# EAGLE board base-module-r1 (EAGLE 5.12)
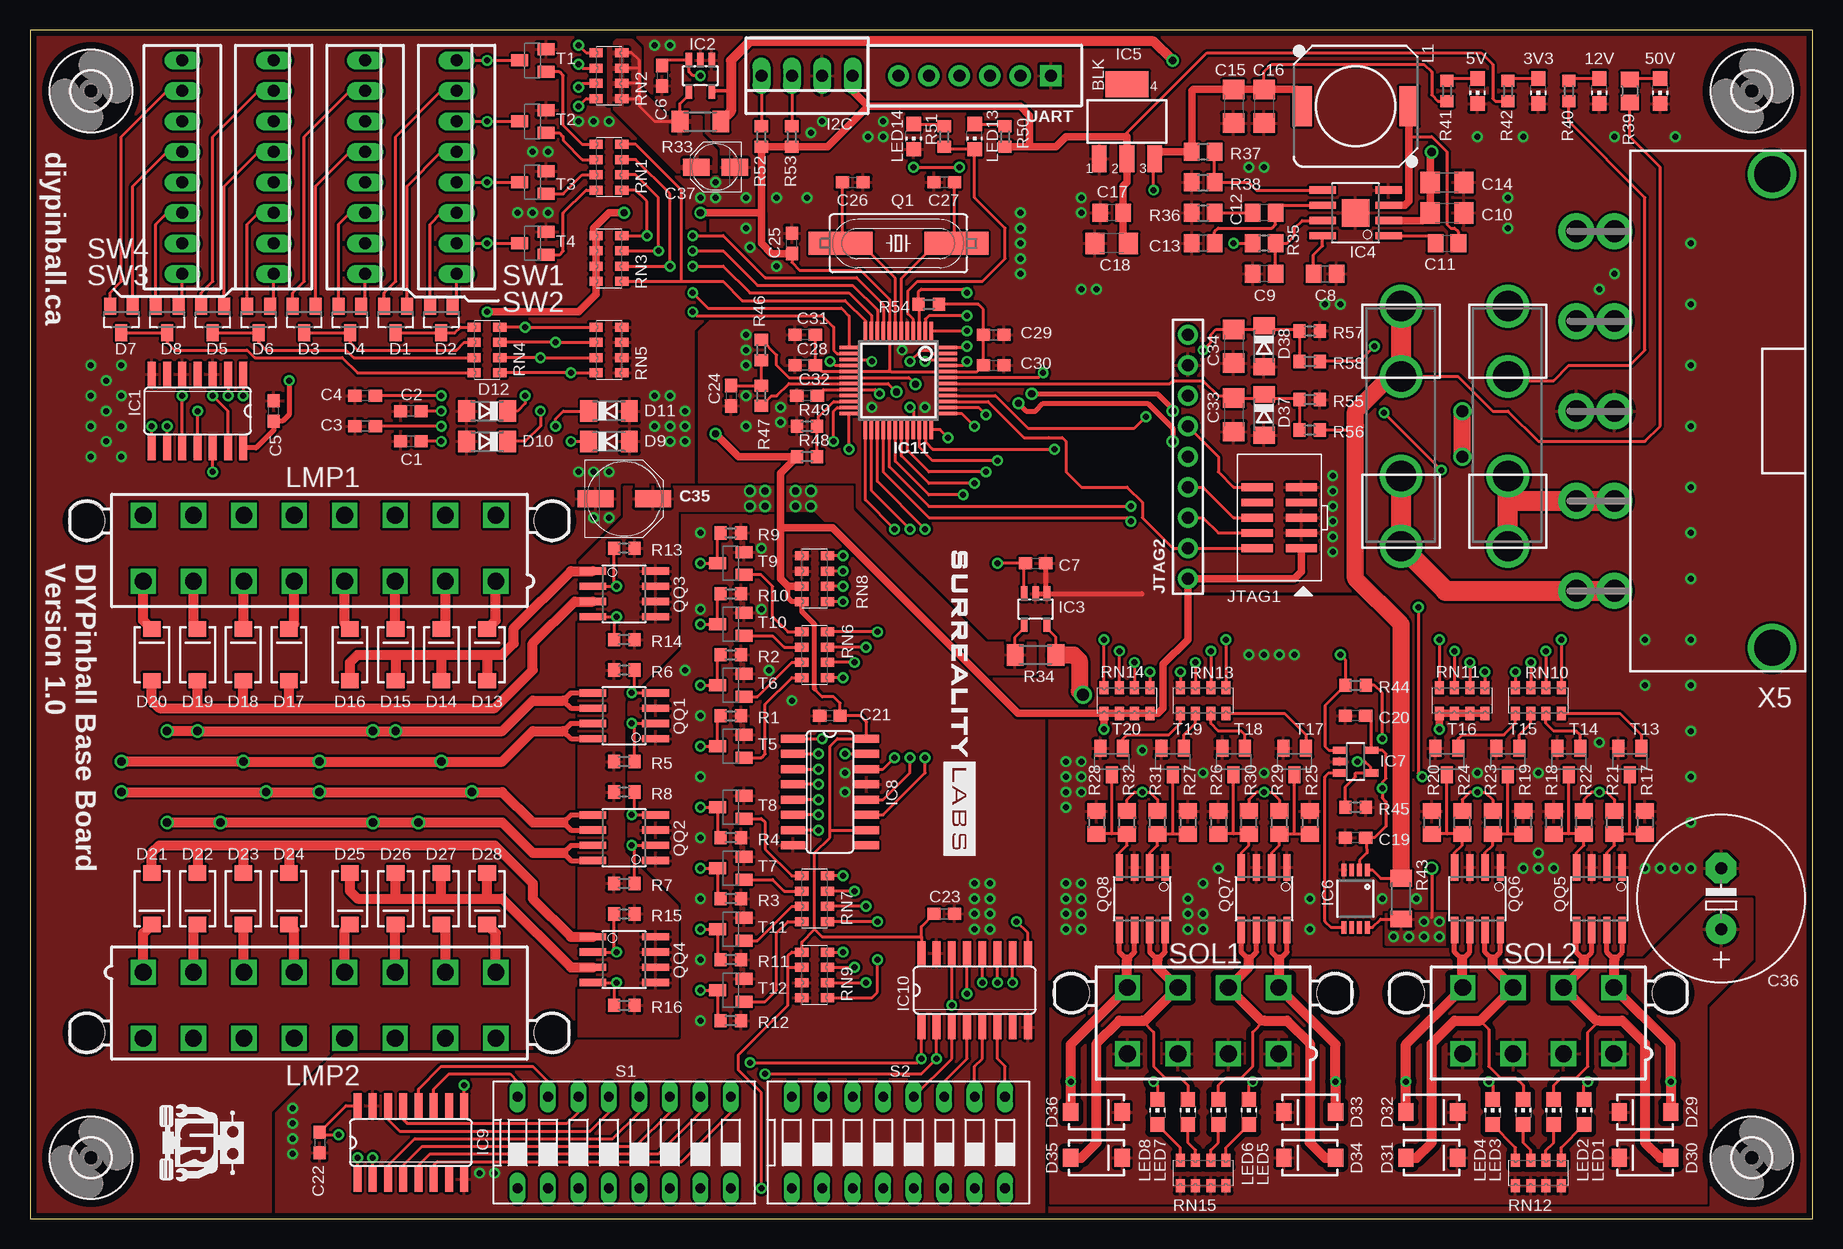
[diagram p4: board, top side]
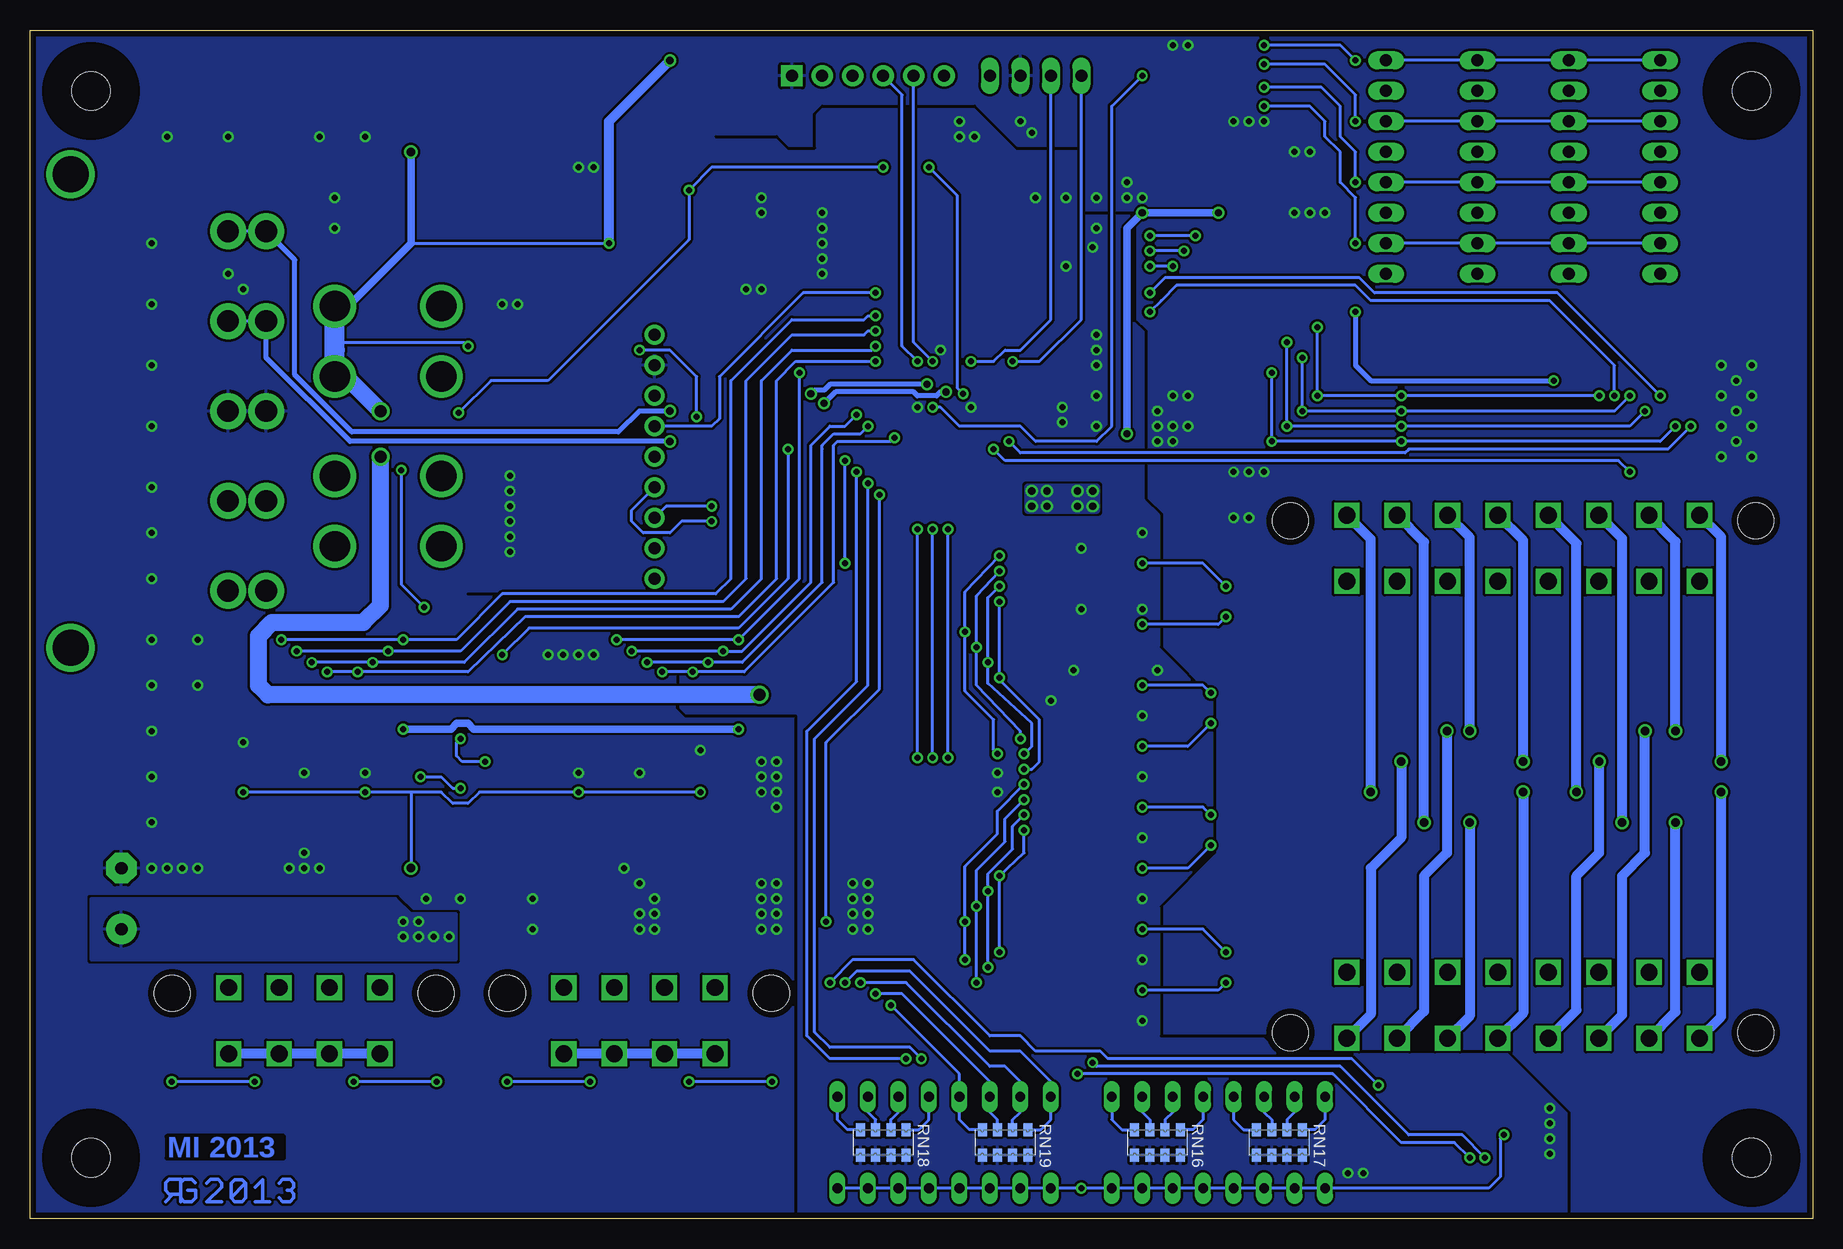
[diagram p5: board, bottom side, seen from below]

Size 148.59 x 99.06 mm. Coordinates in mm from the lower left corner, seen from the top.
Outline: 0,0 148.59,0 148.59,99.06 0,99.06 0,0
Copper layers (1*16): Top 0.035mm / dielectric 1.5mm / Bottom 0.035mm
Design rules "default *": minimum track width 10mil, minimum drill 0.5mm, track to track 8mil, track to pad 8mil, pad to pad 8mil, via to via 8mil, smd to smd 8mil, copper to edge 20mil, drill to drill 8mil, minimum pad ring 10mil, minimum via ring 8mil, stop-mask expansion 4mil, vias tented up to drill 20mil, thermal gap 10mil
Net classes: 1 HV: clearance 0.406 mm
tRestrict: 24 lines
bRestrict: 31 lines

## Footprints (pad centres in the part's own frame; a part is rotated, then mirrored left to right if it is on the bottom)
CHIP-LED0805 = smd 1.2 x 1.2: A 0,-1.05; C 0,1.05
C0603 = smd 1.1 x 1: 1 -0.85,0; 2 0.85,0
C0805 = smd 1.3 x 1.5: 1 -0.95,0; 2 0.95,0
C1206 = smd 1.6 x 1.8: 1 -1.4,0; 2 1.4,0
PANASONIC_D = smd 3 x 1.4: + 2.4,0; - -2.4,0
E5-13 = drill 1.016 pad 2.54 round: + -2.54,0 | drill 1.016 pad 2.54 octagon: - 2.54,0
PANASONIC_B = smd 2.2 x 1.4: + 1.6,0; - -1.6,0
SOT23 = smd 1 x 1.4: 1 -0.95,-1.1; 2 0.95,-1.1; 3 0,1.1
SOD80C = smd 1.4 x 1.8: A 1.7,0; C -1.7,0
SMA-DIODE = smd 1.27 x 1.47: A -2.15,0; C 2.15,0
FUSE_5MM = drill 2.54 pad 3.556 round: 1 0,-10; 2 0,-4.158; 3 0,4.158; 4 0,10
3,2 = hole 3.2: 0,0
22-23-2041 = drill 1 long: 1 -3.81,0; 2 -1.27,0; 3 1.27,0; 4 3.81,0
SO14 = smd 0.66 x 2.032: 1 -3.81,-3.073; 2 -2.54,-3.073; 3 -1.27,-3.073; 4 0,-3.073; 5 1.27,-3.073; 6 2.54,-3.073; 7 3.81,-3.073; 8 3.81,3.073; 9 2.54,3.073; 10 1.27,3.073; 11 0,3.073; 12 -1.27,3.073; 13 -2.54,3.073; 14 -3.81,3.073
SOT23-5L = smd 0.55 x 1.2: 1 -0.95,-1.3; 2 0,-1.3; 3 0.95,-1.3; 4 0.95,1.3; 5 -0.95,1.3
SO08 = smd 0.61 x 2.21: 1 -1.905,-2.75; 2 -0.635,-2.75; 3 0.635,-2.75; 4 1.905,-2.75; 5 1.905,2.75; 6 0.635,2.75; 7 -0.635,2.75; 8 -1.905,2.75 | smd 2.3 x 2.3: SLUG 0,0
SOT223 = smd 1.219 x 2.235: 1 -2.311,-3.099; 2 0,-3.099; 3 2.311,-3.099 | smd 3.6 x 2.2: 4 0,3.099
MSOP-8 = smd 0.41 x 1.02: 1 -0.975,-2.4; 2 -0.325,-2.4; 3 0.325,-2.4; 4 0.975,-2.4; 5 0.975,2.4; 6 0.325,2.4; 7 -0.325,2.4; 8 -0.975,2.4
SOT23-5 = smd 0.6 x 1.2: 1 -0.95,-1.306; 2 0,-1.306; 3 0.95,-1.306; 4 0.95,1.306; 5 -0.95,1.306
SO16 = smd 0.66 x 2.032: 1 -4.445,-3.073; 2 -3.175,-3.073; 3 -1.905,-3.073; 4 -0.635,-3.073; 5 0.635,-3.073; 6 1.905,-3.073; 7 3.175,-3.073; 8 4.445,-3.073; 9 4.445,3.073; 10 3.175,3.073; 11 1.905,3.073; 12 0.635,3.073; 13 -0.635,3.073; 14 -1.905,3.073; 15 -3.175,3.073; 16 -4.445,3.073
LQFP48 = smd 0.3 x 1.6: 1 -2.75,-4.1; 2 -2.25,-4.1; 3 -1.75,-4.1; 4 -1.25,-4.1; 5 -0.75,-4.1; 6 -0.25,-4.1; 7 0.25,-4.1; 8 0.75,-4.1; 9 1.25,-4.1; 10 1.75,-4.1; 11 2.25,-4.1; 12 2.75,-4.1; 25 2.75,4.1; 26 2.25,4.1; 27 1.75,4.1; 28 1.25,4.1; 29 0.75,4.1; 30 0.25,4.1; 31 -0.25,4.1; 32 -0.75,4.1; 33 -1.25,4.1; 34 -1.75,4.1; 35 -2.25,4.1; 36 -2.75,4.1 | smd 1.6 x 0.3: 13 4.1,-2.75; 14 4.1,-2.25; 15 4.1,-1.75; 16 4.1,-1.25; 17 4.1,-0.75; 18 4.1,-0.25; 19 4.1,0.25; 20 4.1,0.75; 21 4.1,1.25; 22 4.1,1.75; 23 4.1,2.25; 24 4.1,2.75; 37 -4.1,2.75; 38 -4.1,2.25; 39 -4.1,1.75; 40 -4.1,1.25; 41 -4.1,0.75; 42 -4.1,0.25; 43 -4.1,-0.25; 44 -4.1,-0.75; 45 -4.1,-1.25; 46 -4.1,-1.75; 47 -4.1,-2.25; 48 -4.1,-2.75
2X05_1.27MM_SMT = smd 0.65 x 2.6: 1 -2.54,-1.85; 2 -2.54,1.85; 3 -1.27,-1.85; 4 -1.27,1.85; 5 0,-1.85; 6 0,1.85; 7 1.27,-1.85; 8 1.27,1.85; 9 2.54,-1.85; 10 2.54,1.85
100MIL-9 = drill 1 pad 1.676 round: 1 -10.16,0; 2 -7.62,0; 3 -5.08,0; 4 -2.54,0; 5 0,0; 6 2.54,0; 7 5.08,0; 8 7.62,0; 9 10.16,0
DR1030 = smd 3.3 x 1.6: 1 0,4.45; 2 0,-4.45
5566-16 = drill 1.4 square: 1 14.7,-2.75; 2 10.5,-2.75; 3 6.3,-2.75; 4 2.1,-2.75; 5 -2.1,-2.75; 6 -6.3,-2.75; 7 -10.5,-2.75; 8 -14.7,-2.75; 9 14.7,2.75; 10 10.5,2.75; 11 6.3,2.75; 12 2.1,2.75; 13 -2.1,2.75; 14 -6.3,2.75; 15 -10.5,2.75; 16 -14.7,2.75 | hole 3: 19.4,2.29; -19.4,2.29
HC49UP = smd 5.334 x 1.93: 1 -4.826,0; 2 4.826,0
SO-8 = smd 2.21 x 0.61: 1 -2.616,1.905; 2 -2.616,0.635; 3 -2.616,-0.635; 4 -2.616,-1.905; 5 2.616,-1.905; 6 2.616,-0.635; 7 2.616,0.635; 8 2.616,1.905
R0603 = smd 1 x 1.1: 1 -0.85,0; 2 0.85,0
R0805 = smd 1.3 x 1.5: 1 -0.95,0; 2 0.95,0
M3516 = smd 1.4 x 1.8: 1 -1.7,0; 2 1.7,0
EXBS8V = smd 0.75 x 1.1: 1 -1.905,-1.07; 2 -0.635,-1.07; 3 0.635,-1.07; 4 1.905,-1.07; 5 1.905,1.07; 6 0.635,1.07; 7 -0.635,1.07; 8 -1.905,1.07
DS-08 = drill 0.813 long: 1 -8.89,-3.81; 2 -6.35,-3.81; 3 -3.81,-3.81; 4 -1.27,-3.81; 5 1.27,-3.81; 6 3.81,-3.81; 7 6.35,-3.81; 8 8.89,-3.81; 9 8.89,3.81; 10 6.35,3.81; 11 3.81,3.81; 12 1.27,3.81; 13 -1.27,3.81; 14 -3.81,3.81; 15 -6.35,3.81; 16 -8.89,3.81
5566-8 = drill 1.4 square: 1 6.3,-2.75; 2 2.1,-2.75; 3 -2.1,-2.75; 4 -6.3,-2.75; 5 6.3,2.75; 6 2.1,2.75; 7 -2.1,2.75; 8 -6.3,2.75 | hole 3: 11,2.29; -11,2.29
22-23-2081 = drill 1 long: 1 -8.89,0; 2 -6.35,0; 3 -3.81,0; 4 -1.27,0; 5 1.27,0; 6 3.81,0; 7 6.35,0; 8 8.89,0
SOT23-BEC = smd 1 x 1.4: B -0.95,-1.1; C 0,1.1; E 0.95,-1.1
USBCABLE-0.100-NOLBL = drill 1 pad 1.778 square: 1 0,-7.62 | drill 1 pad 1.778 round: 2 0,-5.08; 3 0,-2.54; 4 0,0; 5 0,2.54; 6 0,5.08
43160-XX05 = drill 1.8 pad 3 round: 1@1 -14.98,0; 1@2 -14.98,3.18; 2@1 -7.49,0; 2@2 -7.49,3.18; 3@1 0,0; 3@2 0,3.18; 4@1 7.49,0; 4@2 7.49,3.18; 5@1 14.98,0; 5@2 14.98,3.18 | drill 3 pad 3.4 round: M1 -19.73,-13.13; M2 19.73,-13.13

## Placement (x,y rotation side)
3V3  3.3V  [CHIP-LED0805]  125.73,93.98 180 top
5V  5V  [CHIP-LED0805]  120.65,93.98 180 top
12V  12V  [CHIP-LED0805]  130.81,93.98 180 top
50V  PWR  [CHIP-LED0805]  135.89,93.98 180 top
C1  CYA  [C0603]  31.75,64.77 180 top
C2  CYA  [C0603]  31.75,67.31 180 top
C3  CYA  [C0603]  27.94,66.04 180 top
C4  CYA  [C0603]  27.94,68.58 180 top
C5  100n  [C0603]  20.32,67.31 90 top
C6  .047  [C0603]  52.7,95.25 270 top
C7  .047  [C0603]  83.82,54.61 0 top
C8  100n  [C0805]  107.95,78.74 0 top
C9  100n  [C0805]  102.87,78.74 180 top
C10  10u  [C1206]  118.11,83.82 0 top
C11  100n  [C0805]  118.11,81.28 0 top
C12  3.3n  [C0805]  102.87,83.82 180 top
C13  DNP  [C0805]  97.79,81.28 180 top
C14  10u  [C1206]  118.11,86.36 0 top
C15  22u  [C1206]  100.33,92.71 270 top
C16  22u  [C1206]  102.87,92.71 270 top
C17  2.2u  [C0805]  90.17,83.82 180 top
C18  10u  [C1206]  90.17,81.28 180 top
C19  100n  [C0603]  110.49,31.75 180 top
C20  100n  [C0603]  110.49,41.91 180 top
C21  100n  [C0603]  66.67,41.91 180 top
C22  100n  [C0603]  24.13,6.35 270 top
C23  100n  [C0603]  76.2,25.4 0 top
C24  1n  [C0603]  58.42,68.58 270 top
C25  10n  [C0603]  63.5,81.28 90 top
C26  18p  [C0603]  68.58,86.36 0 top
C27  18p  [C0603]  76.2,86.36 180 top
C28  10n  [C0603]  64.61,71.12 180 top
C29  10n  [C0603]  80.33,73.66 0 top
C30  100n  [C0603]  80.33,71.12 0 top
C31  100n  [C0603]  64.61,73.66 180 top
C32  100n  [C0603]  64.77,68.58 180 top
C33  10u  [C1206]  100.33,66.99 270 top
C34  10u  [C1206]  100.33,72.71 270 top
C35  100u  [PANASONIC_D]  49.53,60.01 0 top
C36  220u  [E5-13]  140.97,26.67 90 top
C37  10u  [PANASONIC_B]  57.15,87.63 180 top
D1  BAT54C  [SOT23]  30.48,74.93 180 top
D2  BAT54C  [SOT23]  34.29,74.93 180 top
D3  BAT54C  [SOT23]  22.86,74.93 180 top
D4  BAT54C  [SOT23]  26.67,74.93 180 top
D5  BAT54C  [SOT23]  15.24,74.93 180 top
D6  BAT54C  [SOT23]  19.05,74.93 180 top
D7  BAT54C  [SOT23]  7.62,74.93 180 top
D8  BAT54C  [SOT23]  11.43,74.93 180 top
D9  [SOD80C]  48.26,64.77 0 top
D10  [SOD80C]  38.1,64.77 180 top
D11  [SOD80C]  48.26,67.31 0 top
D12  [SOD80C]  38.1,67.31 180 top
D13  [SMA-DIODE]  38.1,46.99 90 top
D14  [SMA-DIODE]  34.29,46.99 90 top
D15  [SMA-DIODE]  30.48,46.99 90 top
D16  [SMA-DIODE]  26.67,46.99 90 top
D17  [SMA-DIODE]  21.59,46.99 90 top
D18  [SMA-DIODE]  17.78,46.99 90 top
D19  [SMA-DIODE]  13.97,46.99 90 top
D20  [SMA-DIODE]  10.16,46.99 90 top
D21  [SMA-DIODE]  10.16,26.67 270 top
D22  [SMA-DIODE]  13.97,26.67 270 top
D23  [SMA-DIODE]  17.78,26.67 270 top
D24  [SMA-DIODE]  21.59,26.67 270 top
D25  [SMA-DIODE]  26.67,26.67 270 top
D26  [SMA-DIODE]  30.48,26.67 270 top
D27  [SMA-DIODE]  34.29,26.67 270 top
D28  [SMA-DIODE]  38.1,26.67 270 top
D29  [SMA-DIODE]  134.62,8.89 180 top
D30  [SMA-DIODE]  134.62,5.08 180 top
D31  [SMA-DIODE]  116.84,5.08 0 top
D32  [SMA-DIODE]  116.84,8.89 0 top
D33  S1M-FDICT-ND  [SMA-DIODE]  106.68,8.89 180 top
D34  S1M-FDICT-ND  [SMA-DIODE]  106.68,5.08 180 top
D35  S1M-FDICT-ND  [SMA-DIODE]  88.9,5.08 0 top
D36  S1M-FDICT-ND  [SMA-DIODE]  88.9,8.89 0 top
D37  [SOD80C]  102.87,66.99 270 top
D38  [SOD80C]  102.87,72.71 270 top
F1  FUSEX20MM(50A)  [FUSE_5MM]  114.3,66.04 0 top
F2  FUSEX20MM(25A)  [FUSE_5MM]  123.19,66.04 0 top
H1  MOUNT-HOLE3.2  [3,2]  5.08,5.08 0 top
H2  MOUNT-HOLE3.2  [3,2]  143.51,5.08 0 top
H3  MOUNT-HOLE3.2  [3,2]  5.08,93.98 0 top
H4  MOUNT-HOLE3.2  [3,2]  143.51,93.98 0 top
I2C  22-23-2041  [22-23-2041]  64.77,95.25 180 top
IC1  74HC14D  [SO14]  13.97,67.31 180 top
IC2  TS1102  [SOT23-5L]  55.88,95.25 180 top
IC3  TS1102  [SOT23-5L]  83.82,50.8 180 top
IC4  RT7247A  [SO08]  110.49,83.82 90 top
IC5  LM1117-3.3V  [SOT223]  91.44,91.44 0 top
IC6  LMP8480MM  [MSOP-8]  110.49,26.67 180 top
IC7  MCP6001  [SOT23-5]  110.49,38.1 270 top
IC8  74HC595D  [SO16]  66.67,35.56 270 top
IC9  74HC165D  [SO16]  31.75,6.35 0 top
IC10  74HC165D  [SO16]  78.74,19.05 0 top
IC11  LPC11C22/24-LQFP48  [LQFP48]  72.39,69.85 180 top
JTAG1  [2X05_1.27MM_SMT]  104.14,58.42 90 top
JTAG2  M09-100MIL  [100MIL-9]  96.52,63.5 90 top
L1  10uH  [DR1030]  110.49,92.71 270 top
LED1  [CHIP-LED0805]  129.54,8.89 0 top
LED2  [CHIP-LED0805]  127,8.89 0 top
LED3  [CHIP-LED0805]  124.46,8.89 0 top
LED4  [CHIP-LED0805]  121.92,8.89 0 top
LED5  [CHIP-LED0805]  101.6,8.89 0 top
LED6  [CHIP-LED0805]  99.06,8.89 0 top
LED7  [CHIP-LED0805]  96.52,8.89 0 top
LED8  [CHIP-LED0805]  93.98,8.89 0 top
LED13  HBB  [CHIP-LED0805]  78.74,90.17 180 top
LED14  HBA  [CHIP-LED0805]  73.66,90.17 180 top
LMP1  [5566-16]  24.13,55.88 0 top
LMP2  [5566-16]  24.13,17.78 180 top
Q1  12MHz  [HC49UP]  72.39,81.28 0 top
QQ1  DMN6040SSD  [SO-8]  49.53,41.91 180 top
QQ2  DMN6040SSD  [SO-8]  49.53,31.75 180 top
QQ3  IRF9362  [SO-8]  49.53,52.07 0 top
QQ4  IRF9362  [SO-8]  49.53,21.59 0 top
QQ5  DMN6040SSD  [SO-8]  130.81,26.67 270 top
QQ6  DMN6040SSD  [SO-8]  120.65,26.67 270 top
QQ7  DMN6040SSD  [SO-8]  102.87,26.67 270 top
QQ8  DMN6040SSD  [SO-8]  92.71,26.67 270 top
R1  100K  [R0603]  58.42,41.91 180 top
R2  100K  [R0603]  58.42,46.99 180 top
R3  100K  [R0603]  58.42,26.67 180 top
R4  100K  [R0603]  58.42,31.75 180 top
R5  68K  [R0603]  49.53,38.1 180 top
R6  68K  [R0603]  49.53,45.72 180 top
R7  68K  [R0603]  49.53,27.94 180 top
R8  68K  [R0603]  49.53,35.56 180 top
R9  100K  [R0603]  58.42,57.15 180 top
R10  100K  [R0603]  58.42,52.07 180 top
R11  100K  [R0603]  58.42,21.59 180 top
R12  100K  [R0603]  58.42,16.51 180 top
R13  68K  [R0603]  49.53,55.88 0 top
R14  68K  [R0603]  49.53,48.26 0 top
R15  68K  [R0603]  49.53,25.4 0 top
R16  68K  [R0603]  49.53,17.78 0 top
R17  100K  [R0805]  134.62,33.02 270 top
R18  100K  [R0805]  127,33.02 270 top
R19  100K  [R0805]  124.46,33.02 270 top
R20  100K  [R0805]  116.84,33.02 270 top
R21  240K  [R0805]  132.08,33.02 90 top
R22  240K  [R0805]  129.54,33.02 90 top
R23  240K  [R0805]  121.92,33.02 90 top
R24  240K  [R0805]  119.38,33.02 90 top
R25  100K  [R0805]  106.68,33.02 270 top
R26  100K  [R0805]  99.06,33.02 270 top
R27  100K  [R0805]  96.52,33.02 270 top
R28  100K  [R0805]  88.9,33.02 270 top
R29  240K  [R0805]  104.14,33.02 90 top
R30  240K  [R0805]  101.6,33.02 90 top
R31  240K  [R0805]  93.98,33.02 90 top
R32  240K  [R0805]  91.44,33.02 90 top
R33  0.02(MCS1632R020FER)  [M3516]  55.88,91.44 180 top
R34  0.003(PMR18EZPFV3L00)  [M3516]  83.82,46.99 180 top
R35  100K  [R0805]  102.87,81.28 180 top
R36  20K  [R0805]  97.79,83.82 0 top
R37  62K  [R0805]  97.79,88.9 180 top
R38  11.8K  [R0805]  97.79,86.36 0 top
R39  2.2K  [R0805]  133.35,93.98 270 top
R40  1K  [R0603]  128.27,93.98 270 top
R41  330  [R0603]  118.11,93.98 270 top
R42  220  [R0603]  123.19,93.98 270 top
R43  0.001 (CSR1206-0R001F1)  [M3516]  114.3,26.67 270 top
R44  680  [R0603]  110.49,44.45 180 top
R45  1K  [R0603]  110.49,34.29 180 top
R46  60  [R0603]  60.96,72.39 90 top
R47  60  [R0603]  60.96,68.58 90 top
R48  DNP  [R0603]  64.77,63.5 180 top
R49  0  [R0603]  64.77,66.04 180 top
R50  100  [R0603]  81.28,90.17 270 top
R51  100  [R0603]  76.2,90.17 270 top
R52  10K  [R0603]  60.96,90.17 270 top
R53  10K  [R0603]  63.5,90.17 270 top
R54  12K  [R0603]  74.93,76.2 0 top
R55  100K  [R0603]  106.68,68.26 180 top
R56  1.6M  [R0603]  106.68,65.72 0 top
R57  100K  [R0603]  106.68,73.98 180 top
R58  300K  [R0603]  106.68,71.44 0 top
RN1  1K  [EXBS8V]  48.26,87.63 90 top
RN2  10K  [EXBS8V]  48.26,95.25 270 top
RN3  10K  [EXBS8V]  48.26,80.01 90 top
RN4  1K  [EXBS8V]  38.1,72.39 270 top
RN5  10K  [EXBS8V]  48.26,72.39 90 top
RN6  1K  [EXBS8V]  65.41,46.99 90 top
RN7  1K  [EXBS8V]  65.41,26.67 90 top
RN8  10K  [EXBS8V]  65.41,53.34 90 top
RN9  10K  [EXBS8V]  65.41,20.32 270 top
RN10  1K  [EXBS8V]  125.73,43.18 180 top
RN11  10K  [EXBS8V]  119.38,43.18 180 top
RN12  2.2K  [EXBS8V]  125.73,3.81 180 top
RN13  1K  [EXBS8V]  97.79,43.18 180 top
RN14  10K  [EXBS8V]  91.44,43.18 180 top
RN15  2.2K  [EXBS8V]  97.79,3.81 180 top
RN16  10K  [EXBS8V]  54.61,6.35 0 bottom
RN17  10K  [EXBS8V]  44.45,6.35 0 bottom
RN18  10K  [EXBS8V]  77.47,6.35 0 bottom
RN19  10K  [EXBS8V]  67.31,6.35 0 bottom
S1  219-8MST  [DS-08]  49.53,6.35 0 top
S2  219-8MST  [DS-08]  72.39,6.35 0 top
SOL1  [5566-8]  97.79,16.51 0 top
SOL2  [5566-8]  125.73,16.51 0 top
SW1  22-23-2081  [22-23-2081]  35.56,87.63 270 top
SW2  22-23-2081  [22-23-2081]  27.94,87.63 270 top
SW3  22-23-2081  [22-23-2081]  20.32,87.63 270 top
SW4  22-23-2081  [22-23-2081]  12.7,87.63 270 top
T1  MMBT3904  [SOT23-BEC]  41.91,96.52 90 top
T2  MMBT3904  [SOT23-BEC]  41.91,91.44 90 top
T3  MMBT3904  [SOT23-BEC]  41.91,86.36 90 top
T4  MMBT3904  [SOT23-BEC]  41.91,81.28 90 top
T5  MMBT3904  [SOT23-BEC]  58.42,39.37 90 top
T6  MMBT3904  [SOT23-BEC]  58.42,44.45 90 top
T7  MMBT3904  [SOT23-BEC]  58.42,29.21 90 top
T8  MMBT3904  [SOT23-BEC]  58.42,34.29 90 top
T9  MMBT3904  [SOT23-BEC]  58.42,54.61 90 top
T10  MMBT3904  [SOT23-BEC]  58.42,49.53 90 top
T11  MMBT3904  [SOT23-BEC]  58.42,24.13 90 top
T12  MMBT3904  [SOT23-BEC]  58.42,19.05 90 top
T13  MMBT3904  [SOT23-BEC]  133.35,38.1 180 top
T14  MMBT3904  [SOT23-BEC]  128.27,38.1 180 top
T15  MMBT3904  [SOT23-BEC]  123.19,38.1 180 top
T16  MMBT3904  [SOT23-BEC]  118.11,38.1 180 top
T17  MMBT3904  [SOT23-BEC]  105.41,38.1 180 top
T18  MMBT3904  [SOT23-BEC]  100.33,38.1 180 top
T19  MMBT3904  [SOT23-BEC]  95.25,38.1 180 top
T20  MMBT3904  [SOT23-BEC]  90.17,38.1 180 top
U$1  [RGLOGO_SMALL_2013]  135.89,1.27 0 bottom
U$2  [SURREALITY_LOGO_SILK]  76.2,55.88 270 top
U$3  UR_LOGO10  [UR_LOGO_10X10]  13.97,6.35 270 top
UART  TTL-232R-5VN  [USBCABLE-0.100-NOLBL]  77.47,95.25 90 top
X5  43160-3105  [43160-XX05]  132.08,67.31 90 top

## Tracks (layer width: path | path; a pad name or v marks a point on that pad's centre or on a via)
12V_SENSE  (via drill 0.5)
  Top 0.254: R58.1 R57.2 105.7,74.11 102.87,74.11 | 102.87,74.11 C34.1 98.87,74.11 98.42,73.66 98.42,73.03 v97.79,72.39 | 102.87,74.11 D38.C | IC11.40 80.47,68.6 83.19,65.88 92.08,65.88 v93.03,66.83
  Bottom 0.254: v93.03,66.83 93.03,70.17 95.25,72.39 v97.79,72.39
50V_SENSE
  Top 0.254: R56.1 R55.2 105.7,68.39 102.87,68.39 | 102.87,68.39 C33.1 100.14,68.58 99.06,68.58 97.79,69.85 95.25,69.85 95,69.6 IC11.42 | 102.87,68.39 D37.C
+3V3  (via drill 0.5, 0.6)
  Top 0.254: 71.75,70.6 IC11.44 78.96,70.6 C30.1 C29.1 79.48,75.78 79.06,76.2 R54.2 | 71.75,70.6 IC11.17 65.98,70.6 C28.1 C31.1 | 71.75,70.6 71.64,70.72 IC11.8 71.64,76.63 69.22,79.06 64.14,79.06 63.5,79.69 C25.1 | 63.18,20.95 63.18,21.91 63.5,22.23 RN9.1 64.33,23.06 65.41,24.13 | 66.67,32.38 66.67,39.37 67.31,40.01 IC8.16 69.75,41.38 69.22,41.91 C21.1 67.53,42.97 66.99,43.5 66.04,43.5 65.41,44.13 | 66.67,32.38 IC8.10 | 65.41,24.13 65.41,30.48 66.67,31.75 66.67,32.38 | 74.3,23.5 IC10.16 | 74.3,23.5 74.3,24.34 C23.1 | IC9.16 26.35,9.42 C22.1 24.34,6.99 v25.72,6.99 | 66.46,89.32 68.58,91.44 | R42.2 122.14,93.13 121.92,93.34 121.92,96.2 120.97,97.16 98.11,97.16 91.44,90.49 91.44,90.17 | 91.44,88.9 IC5.2 | 63.18,20.95 RN9.2 | 63.18,20.95 63.18,17.78 59.05,13.65 59.05,12.38 60.96,10.48 v60.96,2.54 | 65.41,24.13 66.04,23.5 74.3,23.5 | 96.52,48.26 94.61,46.35
  Top 0.406: IC1.14 18.83,64.24 20.32,65.72 C5.1 21.06,66.46 21.59,66.99 v21.59,69.85 | 65.41,44.13 65.41,49.53 64.33,50.6 RN8.8 63.5,51.44 63.18,51.75 63.18,52.7
  Top 0.61: IC5.2 91.44,86.36 91.12,86.04 C17.1 91.12,81.73 C18.1 | RN14.5 v89.53,40.8 | C25.1 61.81,80.43 60.96,81.28 60.96,83.82 | 60.96,83.82 R52.2 R53.2 66.46,89.32 69.85,92.71 | 83.33,89.32 R50.2 | 83.33,89.32 85.51,89.32 86.36,90.17 91.44,90.17 91.44,88.9 | 83.33,89.32 83.33,91.93 82.55,92.71 69.85,92.71 | I2C.1 68.58,93.98 69.85,92.71 | v49.53,83.82 48.26,83.82 46.99,82.55 46.99,82.11 RN3.5 RN3.6 RN3.7 RN3.8 47.19,77.03 45.72,75.56 v38.1,75.56 | v55.88,83.82 60.96,83.82 | v57.15,65.41 59.05,63.5 R48.2 62.55,62.13 62.55,57.57 | 62.55,57.57 62.55,53.34 63.18,52.7 RN8.7 | 62.55,57.57 66.89,57.57 82.35,42.11 RN14.5 | v117.47,40.8 RN11.5 RN11.6 RN11.7 RN11.8 | RN14.5 RN14.6 RN14.7 RN14.8 94.02,42.11 94.46,42.55 94.46,46.2 96.52,48.26 JTAG2.1 105.41,53.34 105.99,53.92 JTAG1.1
  Bottom 0.254: S2.8 S2.7 S2.6 S2.5 S2.4 S2.3 S2.2 S2.1 v60.96,2.54 S1.8 S1.7 S1.6 S1.5 S1.4 S1.3 S1.2 S1.1 26.99,2.54 26.04,3.49 26.04,6.67 v25.72,6.99
  Bottom 0.406: v38.1,75.56 38.1,71.12 36.83,69.85 v21.59,69.85
  Bottom 0.61: v89.53,40.8 111.6,40.8 112.08,41.27 113.03,41.27 113.51,40.8 v117.47,40.8 | v49.53,83.82 v55.88,83.82 57.15,82.55 v57.15,65.41
+5V  (via drill 0.5)
  Top 0.254: IC6.2 110.81,29.85 111.44,30.48 C19.1 112.08,31.75 113.03,32.7 113.03,34.77 112.71,35.08 v112.71,35.88 112.71,36.35 113.03,36.67 113.03,38.73 112.71,39.05 IC7.5 111.8,41.45 C20.1 | C32.1 66.14,69.1 IC11.20 70.44,69.1 v70.8,68.74 | R41.2 117.37,93.13 116.84,93.66 116.84,95.57 116.2,96.2 103.5,96.2 102.87,95.57 C16.1 | v73.66,87.63 v77.47,87.63 | v93.66,85.72 93.66,88.25 IC5.3 | v112.87,67.15 v117.63,62.39 | v115.73,50.96 115.73,37.15 v116.05,36.83
  Top 0.61: L1.2 106.05,93.66 105.6,94.11 C16.1 C15.1 96.97,94.11 96.84,93.98 R37.2 | R37.2 | R37.2 94.31,88.9 IC5.3
  Bottom 0.254: v70.8,68.74 71.28,69.22 71.28,85.25 v73.66,87.63 | v77.47,87.63 91.76,87.63 v93.66,85.72 93.66,81.6 105.41,69.85 110.17,69.85 v112.87,67.15 | v116.05,36.83 114.3,36.83 113.35,35.88 v112.71,35.88 | v115.73,50.96 117.63,52.86 v117.63,62.39 | v112.87,67.15
+12V  (via drill 0.5, 0.6, 0.7, 1)
  Top 0.254: 56.83,93.67 IC2.5 | IC3.5 84.77,49.22 85.52,48.47 R34.1 | R40.2 128.27,91.44 134.62,85.09 134.62,72.39 133.35,71.12 128.27,71.12 127,69.85 123.54,69.85 F2.3 | v100.33,81.28 R35.2 | v112.08,72.71 110.81,71.44 R58.2
  Top 0.305: 56.83,93.67 57.15,93.98 58.42,93.98
  Top 0.61: IC4.2 116.08,83.19 C10.1 C14.1 116.71,88.77 v116.84,88.9
  Top 0.813: R33.1 58.42,92.28 58.42,93.98 58.42,96.52 60.01,98.11 93.66,98.11 v95.25,96.52
  Top 1.422: R34.1 87,46.99 87.47,46.51 87.47,43.97 v87.79,43.66 | v119.38,63.5 v119.38,67.31
  Bottom 0.254: 116.84,81.28 v100.33,81.28 | v112.08,72.71 112.39,73.03 122.56,73.03 123.19,72.39
  Bottom 0.61: v116.84,88.9 116.84,81.28 121.92,76.2 123.03,76.2 F2.4
  Bottom 0.813: v95.25,96.52 100.33,91.44 v100.33,81.28
  Bottom 1.422: v87.79,43.66 128.75,43.66 129.54,44.45 129.54,48.58 128.43,49.69 120.81,49.69 119.38,51.12 v119.38,63.5 | v119.38,67.31 122.27,70.2 F2.3
  Bottom 1.676: F2.3 123.19,72.39 F2.4 123.19,76.2
CANH  (via drill 0.6)
  Top 0.254: R47.1 61.81,68.58 62.23,68.58 63.25,69.6 IC11.19 71.53,69.6 v72.23,68.9
  Top 0.406: v82.39,67.94 83.03,67.31 83.82,67.31 84.45,67.94 93.19,67.94 95.25,65.88 v95.25,64.77
  Bottom 0.254: X5.4@2 X5.4@1 | X5.4@2 128.4,74.8 128.27,74.93 128.77,74.93 X5.4@2
  Bottom 0.406: v72.23,68.9 72.71,68.9 73.03,68.58 74.61,68.58 74.93,68.9 81.44,68.9 v82.39,67.94 | v95.25,64.77 121.92,64.77 128.91,71.75 X5.4@2
CANL  (via drill 0.6)
  Top 0.254: R46.2 62.23,71.97 62.23,71.12 63.25,70.1 IC11.18 73.25,70.1 v73.82,69.53
  Top 0.406: v83.5,68.74 93.98,68.74 95.25,67.47 v95.25,67.31
  Bottom 0.254: X5.5@2 X5.5@1
  Bottom 0.406: v73.82,69.53 81.92,69.53 82.39,69.06 83.19,69.06 v83.5,68.74 | v95.25,67.31 97.79,67.31 99.54,65.56 121.76,65.56 126.52,70.33 126.52,79.91 X5.5@2 | X5.5@1 132.08,82.07
DIP_CLK  (via drill 0.5)
  Top 0.254: v61.28,12.06 74.3,12.06 v75.56,13.34 IC10.2 | IC9.2 v28.57,5.08 | IC11.32 73.14,64.02 74.93,62.23 v79.69,62.23
  Bottom 0.254: v61.28,12.06 40.01,12.06 34.29,6.35 29.84,6.35 v28.57,5.08 | v75.56,13.34 81.92,13.34 83.82,15.24 83.82,40.64 79.69,44.77 v79.69,62.23
DIP_DAT  (via drill 0.5)
  Top 0.254: IC10.9 83.19,23.81 v82.23,24.77 | v77.79,60.33 74.93,60.33 72.14,63.12 IC11.30
  Bottom 0.254: v82.23,24.77 82.23,39.69 77.79,44.13 v77.79,60.33
DIP_LAT  (via drill 0.5)
  Top 0.254: v60.01,13.02 73.98,13.02 v74.3,13.34 IC10.1 | IC9.1 v27.3,5.08 | v78.74,61.28 74.93,61.28 72.64,63.57 IC11.31
  Bottom 0.254: v60.01,13.02 59.69,12.7 39.37,12.7 33.66,6.99 29.21,6.99 v27.3,5.08 | v74.3,13.34 75.25,14.29 81.92,14.29 83.19,15.56 83.19,40.01 78.74,44.45 v78.74,61.28
FTDI_RXD  (via drill 0.5)
  Top 0.254: IC11.47 75.22,72.1 74.93,72.39 74.3,72.39 v73.34,71.44
  Bottom 0.254: v73.34,71.44 74.93,73.03 UART.5
FTDI_TXD  (via drill 0.5)
  Top 0.254: IC11.46 74.78,71.6 v74.61,71.44
  Bottom 0.254: v74.61,71.44 75.88,72.71 75.88,93.66 UART.4
GND  (via drill 0.5)
  Top 0.406: C7.2 84.67,52.2 IC3.1 | IC3.2 IC3.1 | IC3.1 92.68,52.1 92.71,52.07
  other vias: 72.71,72.39 74.61,67.63 70.17,67.63 62.55,67.63 62.55,66.36 37.47,3.81 38.73,3.81 78.74,25.4 87.63,35.56 86.36,35.56 86.36,34.29 86.36,36.83 87.63,36.83 87.63,38.1 86.36,38.1 78.74,26.67 80.01,26.67 80.01,25.4 80.01,24.13 78.74,24.13 78.74,27.94 80.01,27.94 86.36,27.94 86.36,26.67 86.36,25.4 86.36,24.13 87.63,24.13 87.63,25.4 87.63,26.67 87.63,27.94 52.07,68.58 52.07,66.04 53.34,64.77 53.34,66.04 53.34,68.58 54.61,67.31 54.61,66.04 54.61,64.77 59.69,68.58 59.69,66.04 40.64,83.82 41.91,83.82 43.18,83.82 41.91,88.9 43.18,88.9 5.08,71.12 5.08,68.58 5.08,66.04 5.08,63.5 6.35,64.77 6.35,67.31 6.35,69.85 7.62,71.12 7.62,68.58 7.62,66.04 7.62,63.5 52.07,97.79 53.34,97.79 64.77,85.09 62.23,85.09 59.69,85.09 66.04,91.44 65.09,90.49 71.12,91.44 71.12,90.17 69.85,90.17 87.63,83.82 87.63,85.09 87.63,77.47 88.9,77.47 109.22,76.2 107.95,76.2 101.6,87.63 102.87,87.63 120.65,90.17 124.46,90.17 132.08,90.17 123.19,85.09 123.19,82.55 137.16,90.17 138.43,81.28 138.43,76.2 132.08,78.74 130.81,77.47 138.43,71.12 138.43,66.04 138.43,60.96 138.43,57.15 138.43,53.34 138.43,48.26 134.62,48.26 134.62,44.45 138.43,44.45 138.43,40.64 138.43,36.83 138.43,33.02 138.43,29.21 137.16,29.21 134.62,29.21 135.89,29.21 125.73,30.48 124.46,29.21 125.73,29.21 127,29.21 21.91,9.21 21.91,7.94 21.91,6.67 21.91,5.4 46.99,91.44 48.26,91.44 45.72,91.44 82.55,78.74 82.55,80.01 82.55,81.28 82.55,82.55 82.55,83.82 108.58,61.91 108.58,60.64 108.58,59.37 108.58,58.1 108.58,56.83 108.58,55.56 101.6,46.99 102.87,46.99 104.14,46.99 105.41,46.99 67.94,37.15 67.94,35.56 55.88,21.59 55.88,26.67 55.88,31.75 55.88,36.83 55.88,16.51 55.88,41.91 54.61,45.72 55.88,50.8 55.88,57.15 60.96,55.88 60.96,50.8 61.59,45.72 63.5,43.18 92.71,39.05 97.79,37.15 102.87,37.15 120.65,37.15 125.73,37.15 130.81,39.69 97.79,24.13 96.52,26.67 96.52,24.13 96.52,25.4 97.79,27.94 99.06,29.21 97.79,25.4 106.68,26.67 106.68,24.13 112.71,26.67 115.57,26.67 59.69,71.12 59.69,72.39 59.69,73.66 62.23,79.38 59.69,82.55 60.01,80.96 45.72,62.23 46.99,62.23 48.26,62.23 46.99,58.42 48.26,58.42 57.15,85.09 55.88,85.09 57.15,86.36
  pour Bottom (rank 6): -1.27,100.33 -1.27,-1.27 149.86,-1.27 149.86,100.33
  pour Top (rank 6): -1.27,100.33 149.86,100.33 149.86,-2.54 -1.27,-2.54
HEARTBEAT
  Top 0.254: R51.2 76.4,89.12 LED13.C 78.74,85.09 81.28,82.55 81.28,80.01 79.38,78.11 73.98,78.11 73.18,77.31 73.18,75.41 73.64,74.95 IC11.4
LAMP_12V  (via drill 0.6)
  Top 0.254: IC3.4 82.87,49.22 82.12,48.47 R34.2
  other vias: 60.01,60.64 60.01,59.37 61.28,60.64 61.28,59.37 63.82,59.37 63.82,60.64 65.09,60.64 65.09,59.37
  pour Top: 53.98,15.24 53.98,26.04 49.53,30.48 49.53,43.18 53.98,47.62 53.98,59.05 65.41,59.05 78.74,45.4 83.82,45.4 83.82,47.94 79.69,47.94 68.58,59.05 68.58,60.96 49.53,60.96 49.53,58.42 45.72,54.61 45.72,15.24
  pour Bottom: 59.69,60.96 59.69,59.05 65.41,59.05 65.41,60.96
LAMP_CLK  (via drill 0.5)
  Top 0.254: IC11.27 70.64,61.44 v74.61,57.47 | v74.61,38.42 74.61,37.15 71.12,33.66 IC8.11
  Bottom 0.254: v74.61,38.42 v74.61,57.47
LAMP_COL0  (via drill 0.5)
  Top 0.254: v67.79,45.09 RN6.1 | v67.79,51.44 RN8.1 | IC8.3 v65.72,37.47
  Bottom 0.254: v67.79,51.44 v67.79,45.09 67.63,44.77 64.45,41.59 64.45,38.1 65.09,37.47 v65.72,37.47
LAMP_COL0_PWR  (via drill 0.7)
  Top 0.406: QQ1.7 45.09,41.27 44.45,40.64 45.09,40.01 QQ1.8
  Top 0.813: 44.45,40.64 41.91,40.64 39.37,38.1 v34.29,38.1 v24.13,38.1 v17.78,38.1 v7.62,38.1
  Bottom 0.813: LMP1.16 7.62,56.82 v7.62,38.1 | LMP1.12 24.13,56.53 v24.13,38.1 | LMP2.16 36.83,17.03 36.83,29.21 34.29,31.75 v34.29,38.1 | LMP2.12 19.68,17.38 19.68,28.57 17.78,30.48 v17.78,38.1
LAMP_COL1  (via drill 0.5)
  Top 0.254: v68.74,46.35 RN6.2 | v67.79,52.7 RN8.2 | IC8.2 v65.72,38.73
  Bottom 0.254: v67.79,52.7 68.74,51.75 v68.74,46.35 68.74,44.61 65.09,41.27 65.09,39.37 v65.72,38.73
LAMP_COL1_PWR  (via drill 0.7)
  Top 0.406: QQ1.6 45.09,42.55 44.45,43.18 45.09,43.81 QQ1.5
  Top 0.813: v11.43,40.64 v13.97,40.64 v28.57,40.64 v30.48,40.64 39.37,40.64 41.91,43.18 44.45,43.18
  Bottom 0.813: LMP1.11 28.57,56.77 v28.57,40.64 | LMP1.15 11.43,56.43 v11.43,40.64 | LMP2.11 15.88,16.98 15.88,28.57 13.97,30.48 v13.97,40.64 | LMP2.15 32.38,17.27 32.38,28.57 30.48,30.48 v30.48,40.64
LAMP_COL2  (via drill 0.5)
  Top 0.254: v68.74,27.3 RN7.3 | RN9.7 v68.74,20.95 | v65.72,33.66 IC8.6
  Bottom 0.254: v68.74,20.95 v68.74,27.3 68.74,28.73 66.67,30.8 66.67,32.7 v65.72,33.66
LAMP_COL2_PWR  (via drill 0.7)
  Top 0.406: QQ2.8 45.09,29.84 44.45,30.48 45.09,31.11 QQ2.7
  Top 0.813: 44.45,30.48 41.91,30.48 39.37,33.02 v32.38,33.02 v28.57,33.02 v15.88,33.02 v11.43,33.02
  Bottom 0.813: v11.43,33.02 11.43,17.23 LMP2.10 | LMP1.10 32.38,56.38 v32.38,33.02 | LMP1.14 15.88,56.67 v15.88,33.02 | LMP2.14 28.57,16.89 v28.57,33.02
LAMP_COL3  (via drill 0.5)
  Top 0.254: RN9.8 v67.79,22.23 | v67.79,28.57 RN7.4 | v65.72,32.38 IC8.7
  Bottom 0.254: v67.79,22.23 v67.79,28.57 65.72,30.48 v65.72,32.38
LAMP_COL3_PWR  (via drill 0.7)
  Top 0.406: QQ2.6 45.09,32.38 44.45,33.02 45.09,33.66 QQ2.5
  Top 0.813: 44.45,33.02 41.91,33.02 39.37,35.56 v36.83,35.56 v24.13,35.56 v19.68,35.56 v7.62,35.56
  Bottom 0.813: LMP2.9 7.62,16.84 v7.62,35.56 | LMP1.9 36.83,56.63 v36.83,35.56 | LMP1.13 19.68,56.28 v19.68,35.56 | LMP2.13 24.13,17.13 v24.13,35.56
LAMP_DAT  (via drill 0.5)
  Top 0.254: IC11.25 69.64,59.9 v72.07,57.47 | v72.07,38.42 71.12,37.47 IC8.14
  Bottom 0.254: v72.07,38.42 v72.07,57.47
LAMP_LAT  (via drill 0.5)
  Top 0.254: IC11.26 70.14,60.67 v73.34,57.47 | v73.34,38.42 73.34,37.15 71.12,34.92 IC8.12
  Bottom 0.254: v73.34,38.42 v73.34,57.47
LAMP_ROW0  (via drill 0.5)
  Top 0.254: v70.64,48.9 RN6.4 | v67.79,55.24 RN8.4 | v67.94,38.73 IC8.15
  Bottom 0.254: v67.79,55.24 70.64,52.23 v70.64,48.9 70.64,43.97 68.26,41.59 68.26,39.05 v67.94,38.73
LAMP_ROW0_PWR
  Top 0.813: D16.A 26.67,46.35 27.3,46.99 30.48,46.99 | 38.1,46.99 39.37,46.99 40.32,47.94 40.32,49.21 45.09,53.98 QQ3.1 | 34.29,46.99 38.1,46.99 | 30.48,46.99 34.29,46.99 | 34.29,46.99 D14.A | 30.48,46.99 D15.A | 38.1,46.99 D13.A
LAMP_ROW1  (via drill 0.5)
  Top 0.254: v69.69,47.62 RN6.3 | v67.79,53.98 RN8.3 | IC8.1 v66.04,40.01
  Bottom 0.254: v67.79,53.98 69.69,51.91 v69.69,47.62 69.69,44.45 66.04,40.64 v66.04,40.01
LAMP_ROW1_PWR
  Top 0.813: D20.A 10.16,43.18 10.79,42.55 13.97,42.55 | 21.59,42.55 38.73,42.55 41.91,45.72 41.91,47.94 45.4,51.44 QQ3.3 | 17.78,42.55 21.59,42.55 | 13.97,42.55 17.78,42.55 | 13.97,42.55 D19.A | 17.78,42.55 D18.A | 21.59,42.55 D17.A
LAMP_ROW2  (via drill 0.5)
  Top 0.254: v69.69,26.04 RN7.2 | RN9.6 v69.69,19.68 | v65.72,34.92 IC8.5
  Bottom 0.254: v69.69,19.68 v69.69,26.04 69.69,29.05 67.31,31.43 67.31,33.34 v65.72,34.92
LAMP_ROW2_PWR
  Top 0.813: D21.A 10.16,30.48 10.79,31.11 13.97,31.11 | 21.59,31.11 38.73,31.11 41.91,27.94 41.91,26.67 45.09,23.5 QQ4.1 | 17.78,31.11 21.59,31.11 | 13.97,31.11 17.78,31.11 | 13.97,31.11 D22.A | 17.78,31.11 D23.A | 21.59,31.11 D24.A
LAMP_ROW3  (via drill 0.5)
  Top 0.254: v70.64,24.77 RN7.1 | RN9.5 70.17,18.41 70.64,18.89 70.64,19.05 v70.64,21.59 | v65.72,36.2 IC8.4
  Bottom 0.254: v70.64,21.59 v70.64,24.77 70.64,29.37 67.94,32.07 67.94,33.97 v65.72,36.2
LAMP_ROW3_PWR
  Top 0.813: D25.A 26.67,27.3 27.3,26.67 30.48,26.67 | 38.1,26.67 39.37,26.67 45.09,20.95 QQ4.3 | 34.29,26.67 38.1,26.67 | 30.48,26.67 34.29,26.67 | 38.1,26.67 D28.A | 34.29,26.67 D27.A | 30.48,26.67 D26.A
LAMP_SENSE  (via drill 0.5)
  Top 0.254: IC3.3 82.87,54.51 C7.1 v80.64,54.61 | IC11.34 74.14,64.29 75.25,63.18 v80.64,63.18
  Bottom 0.254: v80.64,54.61 v80.64,63.18
N$1
  Top 0.254: D2.2 33.34,82.87 34.29,83.82 SW1.6
N$2
  Top 0.254: RN1.8 46.35,85.72 44.45,83.82 44.45,80.64 44.13,80.33 T4.B
N$3
  Top 0.254: RN1.7 46.04,87 44.45,85.41 T3.B
N$4
  Top 0.254: T2.B 44.13,90.49 44.45,90.17 44.45,89.85 46.04,88.27 RN1.6
N$5
  Top 0.254: T1.B 44.13,95.57 44.45,95.25 44.45,91.12 46.04,89.53 RN1.5
N$6
  Top 0.254: D1.1 31.43,86.04 34.29,88.9 SW1.4
N$7
  Top 0.254: D1.2 29.53,77.16 30.48,78.11 30.48,90.17 34.29,93.98 SW1.2
N$8
  Top 0.254: SW1.8 35.56,76.35 D2.1
N$9  (via drill 0.5)
  Top 0.254: RN4.5 v45.09,70.48 RN5.8 | v45.09,64.77 D9.C | v34.29,64.77 C1.1 | IC1.9 v11.43,66.04
  Bottom 0.254: v45.09,70.48 v45.09,64.77 v34.29,64.77 12.7,64.77 v11.43,66.04
N$10
  Top 0.254: D4.2 25.72,82.87 26.67,83.82 SW2.6
N$11
  Top 0.254: D3.1 23.81,86.04 26.67,88.9 SW2.4
N$12
  Top 0.254: D3.2 21.91,77.16 22.86,78.11 22.86,90.17 26.67,93.98 SW2.2
N$13
  Top 0.254: SW2.8 27.94,76.35 D4.1
N$14
  Top 0.254: T5.B 60.96,38.42 61.28,38.73 61.28,42.86 63.5,45.09 RN6.8
N$15
  Top 0.254: D6.2 18.1,82.87 19.05,83.82 SW3.6
N$16
  Top 0.254: D5.1 16.19,86.04 19.05,88.9 SW3.4
N$17
  Top 0.254: D5.2 14.29,77.16 15.24,78.11 15.24,90.17 19.05,93.98 SW3.2
N$18
  Top 0.254: SW3.8 20.32,76.35 D6.1
N$19  (via drill 0.5)
  Top 0.254: RN4.6 v42.55,71.75 RN5.7 | v42.55,67.31 42.55,66.04 41.27,64.77 D10.C | v34.29,67.31 C2.1 | IC1.13 16.51,67.31 v15.24,68.58
  Bottom 0.254: v42.55,71.75 v42.55,67.31 v34.29,67.31 16.51,67.31 v15.24,68.58
N$20
  Top 0.254: D8.2 10.48,82.87 11.43,83.82 SW4.6
N$21
  Top 0.254: D7.1 8.57,86.04 11.43,88.9 SW4.4
N$22
  Top 0.254: D7.2 6.67,77.16 7.62,78.11 7.62,90.17 11.43,93.98 SW4.2
N$23
  Top 0.254: SW4.8 12.7,76.35 D8.1
N$24  (via drill 0.5)
  Top 0.254: RN4.7 v43.81,73.03 RN5.6 | D11.C 44.45,67.31 43.81,66.67 v43.81,66.04 | v34.29,66.04 C3.1 | IC1.11 v13.97,67.31
  Bottom 0.254: v43.81,73.03 v43.81,66.04 v34.29,66.04 15.24,66.04 v13.97,67.31
N$25  (via drill 0.5)
  Top 0.254: RN4.8 v41.27,74.3 RN5.5 | D12.C 40.64,67.31 41.27,67.94 v41.27,68.58 | v34.29,68.58 C4.1 | IC1.1 v17.78,68.58
  Bottom 0.254: v41.27,74.3 v41.27,68.58 v34.29,68.58 v17.78,68.58
N$26
  Top 0.254: T6.B 60.65,43.5 63.5,46.35 RN6.7
N$27
  Top 0.254: T7.B 61.91,28.26 62.87,27.3 RN7.6
N$28  (via drill 0.5)
  Top 0.254: QQ1.2 v50.16,41.27 50.38,41.17 R5.1 | v55.88,39.37 T5.C 57.32,41.66 R1.2
  Bottom 0.254: v55.88,39.37 52.07,39.37 v50.16,41.27
N$29  (via drill 0.5)
  Top 0.254: R2.2 57.32,46.74 T6.C v55.88,44.45 | QQ1.4 v50.16,43.81 50.38,43.92 R6.1
  Bottom 0.254: v55.88,44.45 50.8,44.45 v50.16,43.81
N$30  (via drill 0.5)
  Top 0.254: R3.2 57.32,26.92 T7.C v55.88,29.21 | QQ2.2 v50.16,31.11 50.38,31.01 R7.1
  Bottom 0.254: v55.88,29.21 52.07,29.21 v50.16,31.11
N$31  (via drill 0.5)
  Top 0.254: R4.2 57.32,32 T8.C v55.88,34.29 | QQ2.4 v50.16,33.66 50.38,33.76 R8.1
  Bottom 0.254: v55.88,34.29 50.8,34.29 v50.16,33.66
N$32
  Top 0.254: T8.B 60.96,33.34 61.28,33.02 61.28,30.8 63.5,28.57 RN7.5
N$33  (via drill 0.5)
  Top 0.254: R9.2 57.32,56.9 T9.C v55.88,54.61 | QQ3.2 v48.9,52.7 48.68,52.92 R13.1
  Bottom 0.254: v55.88,54.61 50.8,54.61 v48.9,52.7
N$34  (via drill 0.5)
  Top 0.254: R10.2 57.32,51.82 T10.C v55.88,49.53 | QQ3.4 v48.9,50.16 48.68,49.95 R14.1
  Bottom 0.254: v55.88,49.53 49.53,49.53 v48.9,50.16
N$35  (via drill 0.5)
  Top 0.254: R11.2 57.32,21.84 T11.C v55.88,24.13 | QQ4.2 v48.9,22.23 48.68,22.44 R15.1
  Bottom 0.254: v48.9,22.23 50.8,24.13 v55.88,24.13
N$36  (via drill 0.5)
  Top 0.254: R12.2 57.32,16.76 T12.C v55.88,19.05 | QQ4.4 v48.9,19.68 48.68,19.47 R16.1
  Bottom 0.254: v55.88,19.05 49.53,19.05 v48.9,19.68
N$37
  Top 0.254: T9.B 60.96,53.66 61.91,52.7 61.91,50.16 63.18,48.9 RN6.5
N$38
  Top 0.254: T10.B 61.91,48.58 62.87,47.62 RN6.6
N$39
  Top 0.254: T11.B 60.65,23.18 63.5,26.04 RN7.7
N$40
  Top 0.254: RN7.8 63.18,24.77 62.23,23.81 62.23,19.05 61.28,18.1 T12.B
N$41
  Top 0.813: LMP1.1 38.83,49.87 D13.C
N$42
  Top 0.813: LMP1.2 34.63,49.48 D14.C
N$43
  Top 0.813: LMP1.3 30.43,49.19 D15.C
N$44
  Top 0.813: LMP1.4 26.23,49.58 D16.C
N$45
  Top 0.813: LMP1.5 22.03,49.58 D17.C
N$46
  Top 0.813: LMP1.6 17.83,49.19 D18.C
N$47
  Top 0.813: LMP1.7 13.63,49.48 D19.C
N$48
  Top 0.813: LMP1.8 9.43,49.87 D20.C
N$49
  Top 0.254: 133.35,32.07 R21.1 132.08,31.11 131.44,30.48 QQ5.2 | 133.35,32.07 R17.2 | 133.35,32.07 T13.C
N$50
  Top 0.254: 128.27,32.07 R22.1 129.54,31.11 128.91,30.48 QQ5.4 | 128.27,32.07 R18.2 | 128.27,32.07 T14.C
N$51
  Top 0.813: LMP2.1 9.43,23.79 D21.C
N$52
  Top 0.813: LMP2.2 13.63,24.18 D22.C
N$53
  Top 0.813: LMP2.3 17.83,24.47 D23.C
N$54
  Top 0.813: LMP2.4 22.03,24.08 D24.C
N$55
  Top 0.813: LMP2.5 26.23,24.08 D25.C
N$56
  Top 0.813: LMP2.6 30.43,24.47 D26.C
N$57
  Top 0.813: LMP2.7 34.63,24.18 D27.C
N$58
  Top 0.813: LMP2.8 38.83,23.79 D28.C
N$59
  Top 0.254: 123.19,32.07 R23.1 121.92,31.11 121.28,30.48 QQ6.2 | 123.19,32.07 R19.2 | 123.19,32.07 T15.C
N$60
  Top 0.254: 118.11,32.07 R20.2 | 118.11,32.07 R24.1 119.38,31.11 118.75,30.48 QQ6.4 | 118.11,32.07 T16.C
N$61
  Top 0.254: RN10.8 132.51,42.11 134.3,40.32 T13.B
N$62
  Top 0.254: T14.B 129.22,40.33 128.91,40.64 127,40.64 126.36,41.27 RN10.7
N$63
  Top 0.254: T15.B 124.14,40.32 125.09,41.27 RN10.6
N$64
  Top 0.254: T16.B 119.06,40 119.38,40.32 122.87,40.32 123.83,41.27 RN10.5
N$65  (via drill 0.5)
  Top 0.254: LED1.C 129.54,11.11 v129.86,11.43
  Top 0.406: QQ5.8 132.72,22.23 132.08,21.59 131.44,22.23 QQ5.7
  Top 0.813: 132.08,21.59 132.08,19.31 SOL2.5 136.77,14.52 v136.77,11.43 D29.A
  Bottom 0.254: v129.86,11.43 v136.77,11.43
N$66
  Top 0.254: LED2.C 127,11.11 127.64,11.75 128.91,11.75 129.86,12.7 129.86,15.56 130.81,16.51
  Top 0.406: QQ5.6 130.18,22.23 129.54,21.59 128.91,22.23 QQ5.5
  Top 0.813: 129.54,21.59 129.54,20.97 SOL2.6 130.58,16.51 130.81,16.51 132.72,16.51 134.62,14.61 134.62,6.35 135.89,5.08 D30.A
N$67
  Top 0.254: LED3.C 124.46,11.11 123.83,11.75 122.56,11.75 121.6,12.7 121.6,15.79 120.88,16.51
  Top 0.406: QQ6.7 121.28,22.23 121.92,21.59 122.56,22.23 QQ6.8
  Top 0.813: 121.92,21.59 121.92,20.97 SOL2.7 120.88,16.51 118.75,16.51 116.84,14.61 116.84,6.35 115.57,5.08 D31.A
N$68  (via drill 0.5)
  Top 0.254: v121.6,11.43 121.92,11.11 LED4.C
  Top 0.406: QQ6.5 118.75,22.23 119.38,21.59 120.02,22.23 QQ6.6
  Top 0.813: 119.38,21.59 119.38,19.31 SOL2.8 114.69,14.52 v114.69,11.43 D32.A
  Bottom 0.254: v114.69,11.43 v121.6,11.43
N$69
  Top 1.676: X5.2@1 X5.2@2 123.19,59.82 | 123.19,59.82 F2.2 | F2.1 123.19,59.82
N$70
  Top 0.254: RN12.4 123.83,5.93 LED4.A
N$71
  Top 0.254: RN12.3 125.09,5.71 124.46,6.35 LED3.A
N$72
  Top 0.254: RN12.2 126.36,5.71 127,6.35 LED2.A
N$73
  Top 0.254: RN12.1 127.64,5.93 LED1.A
N$74
  Top 0.254: 105.41,32.07 R29.1 104.14,31.11 103.5,30.48 QQ7.2 | 105.41,32.07 R25.2 | 105.41,32.07 T17.C
N$75
  Top 0.254: 100.33,32.07 R26.2 | 100.33,32.07 R30.1 101.6,31.11 100.97,30.48 QQ7.4 | 100.33,32.07 T18.C
N$76
  Top 0.254: 95.25,32.07 R27.2 | 95.25,32.07 T19.C | 95.25,32.07 R31.1 93.98,31.11 93.34,30.48 QQ8.2
N$77
  Top 0.254: QQ8.4 90.81,30.48 91.44,31.11 R32.1 90.17,32.07 | 90.17,32.07 R28.2 | 90.17,32.07 T20.C
N$78
  Top 0.254: RN13.8 104.58,42.11 106.36,40.32 T17.B
N$79
  Top 0.254: RN13.7 98.42,41.27 99.06,40.64 100.97,40.64 101.28,40.32 T18.B
N$80
  Top 0.254: RN13.6 97.16,41.27 96.2,40.32 T19.B
N$81
  Top 0.254: RN13.5 95.89,41.27 94.93,40.32 91.44,40.32 91.12,40.01 T20.B
N$82  (via drill 0.5)
  Top 0.254: LED5.C 101.6,11.11 v101.92,11.43
  Top 0.406: QQ7.7 103.5,22.23 104.14,21.59 104.78,22.23 QQ7.8
  Top 0.813: 104.14,21.59 104.14,19.31 SOL1.5 108.83,14.52 v108.83,11.43 D33.A
  Bottom 0.254: v101.92,11.43 v108.83,11.43
N$83
  Top 0.254: LED6.C 99.06,11.11 99.69,11.75 100.97,11.75 101.92,12.7 101.92,15.56 102.87,16.51
  Top 0.406: QQ7.6 102.23,22.23 101.6,21.59 100.97,22.23 QQ7.5
  Top 0.813: 101.6,21.59 101.6,20.97 SOL1.6 102.64,16.51 102.87,16.51 104.78,16.51 106.68,14.61 106.68,6.35 107.95,5.08 D34.A
N$84
  Top 0.254: LED7.C 96.52,11.11 95.89,11.75 94.61,11.75 93.66,12.7 93.66,15.56 92.71,16.51
  Top 0.406: QQ8.7 93.34,22.23 93.98,21.59 94.61,22.23 QQ8.8
  Top 0.813: 93.98,21.59 93.98,20.97 SOL1.7 92.94,16.51 92.71,16.51 90.81,16.51 88.9,14.61 88.9,6.35 87.63,5.08 D35.A
N$85  (via drill 0.5)
  Top 0.254: v93.66,11.43 93.98,11.11 LED8.C
  Top 0.406: QQ8.5 90.81,22.23 91.44,21.59 92.08,22.23 QQ8.6
  Top 0.813: 91.44,21.59 91.44,19.31 SOL1.8 86.75,14.52 v86.75,11.43 D36.A
  Bottom 0.254: v86.75,11.43 v93.66,11.43
N$86
  Top 0.254: RN15.4 95.89,5.93 LED8.A
N$87
  Top 0.254: RN15.3 97.16,5.71 96.52,6.35 LED7.A
N$88
  Top 0.254: RN15.2 98.42,5.71 99.06,6.35 LED6.A
N$89
  Top 0.254: RN15.1 99.69,5.93 LED5.A
N$90
  Top 1.676: X5.1@1 X5.1@2 118.01,52.33 F1.1 F1.2
N$91
  Top 0.254: 12V.A 128.47,95.03 R40.1
N$92
  Top 0.254: IC4.8 107.74,81.07 107,80.33 C8.1
N$93  (via drill 0.5)
  Top 0.254: R45.2 109.64,35.98 110.49,36.83 110.49,37.15 IC7.4 111.76,37.19 111.76,37.62 111.28,38.1 v110.65,38.1 | v112.71,40.01 112.71,43.81 112.08,44.45 R44.1
  Bottom 0.254: v110.65,38.1 112.55,38.1 113.03,38.58 113.03,39.69 v112.71,40.01
N$94
  Top 0.254: 50V.A 133.45,95.03 R39.1
N$95
  Top 0.254: IC4.1 116.53,81.92 C11.1
N$96
  Top 0.254: C11.2 119.06,82.23 118.75,82.55 118.43,82.55 118.11,82.87 118.11,88.9 116.84,90.17 114.94,90.17
  Top 0.61: IC4.3 114.62,84.45 114.94,84.77 114.94,90.17 L1.1
N$97
  Top 0.254: C13.1 98.74,82.23 99.06,82.55 103.5,82.55 103.82,82.86 C12.1 104.45,84.45 IC4.6
N$98
  Top 0.254: R36.2 C12.2
N$99
  Top 0.254: R37.1 R38.2 101.6,86.36 102.23,85.72 IC4.5
N$100
  Top 0.254: 5V.A 118.31,95.03 R41.1
N$101
  Top 0.254: 3V3.A 123.39,95.03 R42.1
N$102
  Top 0.254: IC7.3 108.27,37.15 107.95,36.83 107.95,24.77 108.44,24.27 IC6.5
N$103
  Top 0.254: IC11.22 66.99,68.1 65.72,66.83 65.72,66.04 R49.1 R48.1
N$104
  Top 0.254: IC9.6 33.66,4.45 33.97,4.76 54.29,4.76 58.42,8.89 S1.9
  Bottom 0.254: RN16.8 57.59,7.42 58.42,8.26 S1.9
N$105
  Top 0.254: IC9.5 32.38,4.45 33.34,5.4 52.39,5.4 55.88,8.89 S1.10
  Bottom 0.254: RN16.7 55.24,8.26 55.88,8.89 S1.10
N$106
  Top 0.254: IC9.4 31.11,4.45 32.7,6.03 50.48,6.03 53.34,8.89 S1.11
  Bottom 0.254: RN16.6 53.98,8.26 53.34,8.89 S1.11
N$107
  Top 0.254: IC9.3 29.84,4.45 32.07,6.67 48.58,6.67 50.8,8.89 S1.12
  Bottom 0.254: RN16.5 51.63,7.42 50.8,8.26 S1.12
N$108
  Top 0.254: IC9.14 29.84,8.26 30.8,7.3 46.67,7.3 48.26,8.89 S1.13
  Bottom 0.254: RN17.8 47.42,7.42 48.26,8.26 S1.13
N$109
  Top 0.254: IC9.13 31.11,8.26 31.43,7.94 44.77,7.94 45.72,8.89 S1.14
  Bottom 0.254: RN17.7 45.09,8.26 45.72,8.89 S1.14
N$110
  Top 0.254: IC9.12 32.38,10.79 34.29,12.7 41.91,12.7 43.18,11.43 S1.15
  Bottom 0.254: RN17.6 43.81,8.26 43.18,8.89 S1.15
N$111
  Top 0.254: IC9.11 33.66,10.79 34.92,12.06 40.01,12.06 40.64,11.43 S1.16
  Bottom 0.254: RN17.5 41.48,7.42 40.64,8.26 S1.16
N$112
  Top 0.254: IC10.6 80.64,13.34 81.28,12.7 S2.9
  Bottom 0.254: RN18.8 80.44,7.42 81.28,8.26 S2.9
N$113
  Top 0.254: IC10.5 79.38,13.34 78.74,12.7 S2.10
  Bottom 0.254: RN18.7 78.11,8.26 78.74,8.89 S2.10
N$114
  Top 0.254: IC10.4 78.11,13.34 76.2,11.43 S2.11
  Bottom 0.254: RN18.6 76.83,8.26 76.2,8.89 S2.11
N$115
  Top 0.254: IC10.3 76.83,13.34 S2.12
  Bottom 0.254: RN18.5 74.5,7.42 73.66,8.26 S2.12
N$116  (via drill 0.5)
  Top 0.254: v76.83,17.78 IC10.14
  Bottom 0.254: RN19.8 70.28,7.42 71.12,8.26 S2.13 71.12,12.06 v76.83,17.78
N$117  (via drill 0.5)
  Top 0.254: v78.11,18.73 IC10.13
  Bottom 0.254: RN19.7 67.94,8.26 68.58,8.89 S2.14 68.58,11.43 75.88,18.73 v78.11,18.73
N$118  (via drill 0.5)
  Top 0.254: v79.38,19.68 IC10.12
  Bottom 0.254: RN19.6 66.67,8.26 66.04,8.89 S2.15 66.04,11.43 67.31,12.7 68.58,12.7 75.56,19.68 v79.38,19.68
N$119  (via drill 0.5)
  Top 0.254: v80.64,19.68 IC10.11
  Bottom 0.254: RN19.5 64.33,7.42 63.5,8.26 S2.16 63.5,11.43 66.04,13.97 68.58,13.97 75.25,20.64 79.69,20.64 v80.64,19.68
N$120  (via drill 0.5)
  Top 0.254: v81.92,19.68 IC10.10 | IC9.9 v36.2,11.11
  Bottom 0.254: v81.92,19.68 80.01,21.59 74.93,21.59 68.58,15.24 66.04,15.24 64.77,13.97 59.37,13.97 58.74,13.34 38.42,13.34 v36.2,11.11
N$121
  Top 0.254: IC11.7 72.14,78.36 69.22,81.28 Q1.1 67.73,81.45 C26.1
N$122
  Top 0.254: C24.1 R47.2 R46.1
N$123
  Top 0.254: IC11.6 72.64,78.36 75.56,81.28 Q1.2 77.05,81.45 C27.1
N$126
  Top 0.254: LED13.A 81.08,91.22 R50.1
N$127
  Top 0.254: LED14.A 76,91.22 R51.1
PWR_EN
  Top 0.254: C9.1 R35.1 104.78,81.28 105.41,81.92 105.41,82.55 106.05,83.19 IC4.7
RESET  (via drill 0.5)
  Top 0.254: IC11.3 74.14,76.14 R54.1 74.08,77.25 74.3,77.47 77.79,77.47 v78.11,77.15 | JTAG1.10 100.33,60.96 99.06,62.23 99.06,63.5 JTAG2.6
  Bottom 0.254: JTAG2.6 91.76,66.04 91.12,66.67 91.12,70.17 84.14,77.15 v78.11,77.15
SCL  (via drill 0.5)
  Top 0.254: I2C.3 R53.1 | IC11.15 70,71.6 v70.17,71.44
  Bottom 0.254: v70.17,71.44 68.26,71.44 67.31,72.39 66.04,72.39 63.5,74.93 I2C.3
SDA  (via drill 0.5)
  Top 0.254: I2C.4 R52.1 | IC11.16 67.17,71.1 v66.67,71.44
  Bottom 0.254: v66.67,71.44 64.45,71.44 60.96,74.93 I2C.4
SOLENOID0  (via drill 0.5)
  Top 0.254: v127.64,48.26 RN10.1 | v117.47,48.26 RN11.4 | IC11.2 74.64,74.96 74.93,75.25 v78.11,75.25
  Bottom 0.254: v127.64,48.26 v117.47,48.26 113.03,48.26 109.22,52.07 91.44,52.07 90.17,53.34 90.17,69.85 85.09,74.93 79.06,74.93 78.74,75.25 v78.11,75.25
SOLENOID1  (via drill 0.5)
  Top 0.254: v126.36,47.31 RN10.2 | v118.75,47.31 RN11.3 | IC11.1 78.13,73.95 v78.11,73.98
  Bottom 0.254: v126.36,47.31 v118.75,47.31 112.71,47.31 108.58,51.44 90.81,51.44 88.9,53.34 88.9,69.85 85.09,73.66 79.06,73.66 78.74,73.98 v78.11,73.98
SOLENOID2  (via drill 0.5)
  Top 0.254: v125.09,46.35 RN10.3 | v120.02,46.35 RN11.2 | IC11.48 78,72.6 v78.11,72.71
  Bottom 0.254: v125.09,46.35 v120.02,46.35 112.39,46.35 107.95,50.8 90.17,50.8 87.63,53.34 87.63,69.85 85.09,72.39 78.42,72.39 v78.11,72.71
SOLENOID3  (via drill 0.5)
  Top 0.254: v121.28,45.56 RN11.1 | v123.83,45.56 RN10.4 | IC11.45 77.77,71.1 v78.11,71.44
  Bottom 0.254: v123.83,45.56 v121.28,45.56 112.08,45.56 107.31,50.16 89.53,50.16 86.36,53.34 86.36,69.85 84.77,71.44 v78.11,71.44
SOLENOID4  (via drill 0.5)
  Top 0.254: RN14.4 v89.53,48.26 | v99.69,48.26 RN13.1 | IC11.43 84.07,70.1 v84.45,70.48
  Bottom 0.254: v99.69,48.26 v89.53,48.26 84.45,53.34 v84.45,70.48
SOLENOID5  (via drill 0.5)
  Top 0.254: v98.42,47.31 RN13.2 | RN14.3 v90.81,47.31 | IC11.38 79.08,67.6 v79.69,66.99
  Bottom 0.254: v98.42,47.31 v90.81,47.31 89.22,47.31 83.5,53.02 83.5,64.45 81.92,66.04 80.64,66.04 v79.69,66.99
SOLENOID6  (via drill 0.5)
  Top 0.254: v92.08,46.35 RN14.2 | v97.16,46.35 RN13.3 | IC11.37 77.68,67.1 v78.74,66.04
  Bottom 0.254: v97.16,46.35 v92.08,46.35 89.22,46.35 82.55,53.02 82.55,64.14 82.55,64.45 81.6,65.41 79.38,65.41 v78.74,66.04
SOLENOID7  (via drill 0.5)
  Top 0.254: v95.89,45.56 RN13.4 | v93.34,45.56 RN14.1 | IC11.36 75.86,65.75 v76.52,65.09
  Bottom 0.254: v95.89,45.56 v93.34,45.56 89.06,45.56 81.6,53.02 81.6,64.45 81.28,64.77 76.83,64.77 v76.52,65.09
SOLENOID_50V  (via drill 0.5, 0.7)
  Top 0.254: R43.2 112.6,24.97 111.9,24.27 IC6.8 | R23.2 121.92,34.92 121.28,35.56 v120.65,35.56 120.02,35.56 119.38,34.92 R24.2 | R21.2 132.08,34.92 131.44,35.56 v130.81,35.56 130.18,35.56 129.54,34.92 R22.2 | R32.2 91.44,34.92 92.08,35.56 v92.71,35.56 93.34,35.56 93.98,34.92 R31.2 | R29.2 104.14,34.92 103.5,35.56 v102.87,35.56 102.23,35.56 101.6,34.92 R30.2 | v116.84,29.21 116.84,25.08
  Bottom 0.254: v130.81,35.56 v120.65,35.56 116.84,35.56 | 116.84,35.56 114.3,35.56 113.35,34.61 112.08,34.61 111.12,35.56 v102.87,35.56 v92.71,35.56 | 116.84,35.56 v116.84,29.21
  Bottom 0.813: SOL1.4 SOL1.3 SOL1.2 SOL1.1 | SOL2.4 SOL2.3 SOL2.2 SOL2.1
  other vias: 113.67,23.5 114.94,23.5 116.2,23.5 116.2,24.77 117.47,24.77 117.47,23.5
  pour Top (rank 2): 85.09,21.59 134.62,21.59 139.7,26.67 143.51,26.67 143.51,21.59 139.7,17.78 139.7,1.27 85.09,1.27
  pour Bottom: 143.51,26.67 143.51,21.59 113.03,21.59 113.03,25.4 116.84,25.4 118.11,26.67
  pour Top: 113.03,22.86 118.11,22.86 118.11,25.4 113.03,25.4
SOLENOID_SENSE  (via drill 0.5)
  Top 0.254: IC7.1 108.27,39.05 107.95,39.37 107.95,42.76 R44.2 109.64,46.57 v109.22,46.99 | IC11.35 74.64,64.74 75.25,64.14 v85.41,64.14
  Bottom 0.254: v85.41,64.14 85.41,53.34 89.53,49.21 107,49.21 v109.22,46.99
SWCLK  (via drill 0.5)
  Top 0.254: JTAG1.4 99.06,57.15 97.79,58.42 JTAG2.3 | IC11.29 71.64,62.66 74.93,59.37 v91.76,59.37
  Bottom 0.254: v91.76,59.37 95.57,59.37 JTAG2.3
SWDIO
  Top 0.254: JTAG1.2 JTAG2.2 95.25,55.88 92.71,58.42 92.71,59.69 91.44,60.96 87.63,60.96 86.36,62.23 86.36,64.77 86.04,65.09 84.93,65.09 82.87,65.09 79.86,68.1 IC11.39
SWITCH_12V
  Top 0.254: IC2.4 54.93,93.67 54.18,92.92 R33.2 52.07,91.44 50.8,92.71 50.8,93.34 | RN2.8 50.16,97.16 50.8,96.52 50.8,95.89 | 50.8,93.34 50.8,94.61 | 50.8,94.61 50.8,95.89 | RN2.5 50.8,93.34 | 50.8,94.61 RN2.6 | 50.8,95.89 RN2.7
  pour Top: 48.26,97.47 48.26,93.03 53.98,87.31 57.15,87.31 57.15,88.9 55.88,90.17 55.88,91.76 53.02,91.76 50.8,93.98 50.8,97.47 50.16,98.11 48.9,98.11
SWITCH_COL0
  Top 0.254: RN1.4 50.48,89.53 54.29,85.72 54.29,78.11 | RN3.1 54.29,78.11 | IC11.12 69.64,74.82 67.94,76.52 59.37,76.52 57.78,78.11 54.29,78.11
SWITCH_COL0_PWR  (via drill 0.5)
  Top 0.254: SW1.1 v38.1,96.52 T1.C | RN2.1 46.35,97.16 v45.72,97.79
  Bottom 0.254: SW1.1 SW2.1 SW3.1 SW4.1 | v45.72,97.79 39.37,97.79 v38.1,96.52
SWITCH_COL1  (via drill 0.5)
  Top 0.254: RN1.3 50.48,88.27 53.34,85.41 v53.34,79.38 RN3.2 | v55.24,79.38 57.78,79.38 60.01,77.15 68.26,77.15 70.14,75.28 IC11.11
  Bottom 0.254: v53.34,79.38 v55.24,79.38
SWITCH_COL1_PWR  (via drill 0.5)
  Top 0.254: SW1.3 v38.1,91.44 T2.C | RN2.2 46.04,95.89 v45.72,96.2
  Bottom 0.254: SW4.3 SW3.3 SW2.3 SW1.3 | v45.72,96.2 40.64,96.2 38.1,93.66 v38.1,91.44
SWITCH_COL2  (via drill 0.5)
  Top 0.254: RN1.2 50.48,87 52.39,85.09 v52.39,80.64 RN3.3 | v55.24,80.64 57.78,80.64 60.64,77.79 68.58,77.79 70.64,75.73 IC11.10
  Bottom 0.254: v52.39,80.64 v55.24,80.64
SWITCH_COL2_PWR  (via drill 0.5)
  Top 0.254: SW1.5 v38.1,86.36 T3.C | RN2.3 46.04,94.61 v45.72,94.3
  Bottom 0.254: SW1.5 SW2.5 SW3.5 SW4.5 | v45.72,94.3 40.96,94.3 39.37,92.71 39.37,90.17 38.1,88.9 v38.1,86.36
SWITCH_COL3  (via drill 0.5)
  Top 0.254: RN1.1 50.48,85.72 51.44,84.77 v51.44,81.92 RN3.4 | IC11.9 71.14,76.18 68.9,78.42 61.28,78.42 57.78,81.92 v55.24,81.92
  Bottom 0.254: v51.44,81.92 v55.24,81.92
SWITCH_COL3_PWR  (via drill 0.5)
  Top 0.254: SW1.7 v38.1,81.28 T4.C | RN2.4 46.35,93.34 v45.72,92.71
  Bottom 0.254: SW4.7 SW3.7 SW2.7 SW1.7 | v45.72,92.71 41.91,92.71 40.64,91.44 40.64,90.17 39.37,88.9 39.37,86.36 38.1,85.09 v38.1,81.28
SWITCH_ROW0  (via drill 0.5)
  Top 0.254: IC1.8 v10.16,66.04 | IC11.23 67.28,67.6 66.99,67.31 v66.99,64.77
  Bottom 0.254: v10.16,66.04 12.06,64.14 33.66,64.14 33.97,63.82 66.04,63.82 v66.99,64.77
SWITCH_ROW0_PWR
  Top 0.254: D1.3 D2.3 35.41,73.83 35.88,74.3 RN4.1
SWITCH_ROW1  (via drill 0.5)
  Top 0.254: IC11.24 68.29,64.16 v68.26,64.14 | v15.24,62.23 IC1.12
  Bottom 0.254: v68.26,64.14 67.31,63.18 16.19,63.18 v15.24,62.23
SWITCH_ROW1_PWR
  Top 0.254: D3.3 D4.3 26.67,73.03 27.3,72.39 35.56,72.39 36.2,73.03 RN4.2
SWITCH_ROW2  (via drill 0.5)
  Top 0.254: IC11.13 68.29,75.22 67.63,75.88 56.52,75.88 v55.24,77.15 | IC1.10 v12.7,68.58
  Bottom 0.254: v55.24,77.15 53.98,78.42 37.78,78.42 36.51,77.15 21.27,77.15 v12.7,68.58
SWITCH_ROW2_PWR
  Top 0.254: D5.3 D6.3 19.05,73.03 19.68,72.39 26.35,72.39 26.99,71.75 RN4.3
SWITCH_ROW3  (via drill 0.5)
  Top 0.254: IC11.14 67.28,72.1 66.99,72.39 66.99,74.3 66.04,75.25 55.56,75.25 v55.24,75.56 | IC1.2 v16.51,68.58
  Bottom 0.254: v55.24,75.56 54.29,76.52 53.02,77.79 38.1,77.79 36.83,76.52 21.91,76.52 16.51,71.12 v16.51,68.58
SWITCH_ROW3_PWR
  Top 0.254: D7.3 D8.3 11.43,73.03 12.06,72.39 18.1,72.39 18.73,71.75 26.04,71.75 27.3,70.48 RN4.4
SWITCH_SENSE  (via drill 0.5)
  Top 0.254: C6.1 53.16,96.55 IC2.3 54.93,95.57 55.24,95.25 v55.88,95.25 | IC11.33 73.64,67.33 v73.34,67.63
  Bottom 0.254: v73.34,67.63 72.71,67.63 71.12,66.04 66.04,66.04 64.77,64.77 59.69,64.77 58.42,66.04 58.42,92.71 v55.88,95.25
SWO  (via drill 0.5)
  Top 0.254: JTAG1.6 100.33,58.42 97.79,60.96 JTAG2.4 | IC11.28 71.14,62.21 74.93,58.42 91.44,58.42 v91.76,58.1
  Bottom 0.254: v91.76,58.1 94.3,58.1 95.25,57.15 97.47,57.15 98.42,58.1 98.42,59.05 JTAG2.4
V+
  Top 0.254: R43.1 112.6,28.37 111.9,29.07 IC6.1 | R39.2 133.35,90.17 135.89,87.63 135.89,66.04 134.62,64.77 125.73,64.77 123.19,67.31 121.92,67.31 119.03,70.2 F1.3 | R56.2 110.17,65.72 110.49,66.04
  Top 1.422: 113.38,70.2 110.49,67.31 110.49,66.04 110.49,53.34 114.3,49.53 R43.1
  Top 1.676: 113.38,70.2 F1.3 F1.4

## Text on the board
Bottom: MI 2013
tNames: diypinball.ca | Version 1.0 | DIYPinball Base Board